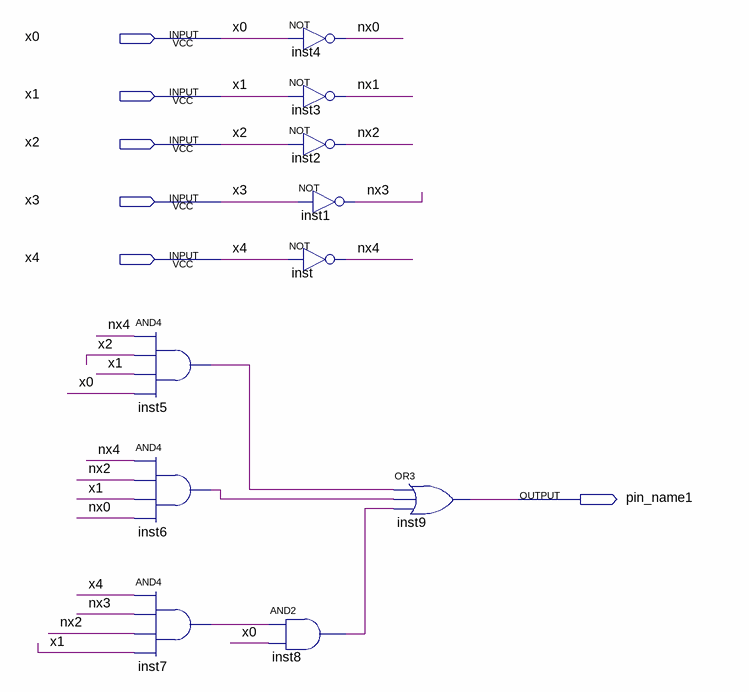
[diagram p0: schematic sheet]
// Quartus schematic mode5_logic.bdf as structural Verilog: 10 symbols, 6 pins
module mode5_logic (
  input  x0,
  input  x1,
  input  x2,
  input  x3,
  input  x4,
  output pin_name1
);

  wire inst5_out, inst6_out, inst7_out, inst8_out, nx0, nx1, nx2, nx3, nx4;

  and inst5 (inst5_out, nx4, x2, x1, x0);
  and inst6 (inst6_out, nx4, nx2, x1, nx0);
  and inst7 (inst7_out, x4, nx3, nx2, x1);
  not inst4 (nx0, x0);
  not inst3 (nx1, x1);
  not inst2 (nx2, x2);
  not inst1 (nx3, x3);
  not inst (nx4, x4);
  and inst8 (inst8_out, inst7_out, x0);
  or inst9 (pin_name1, inst5_out, inst6_out, inst8_out);
endmodule
